# EAGLE design mainboard (EAGLE 7.5.0)
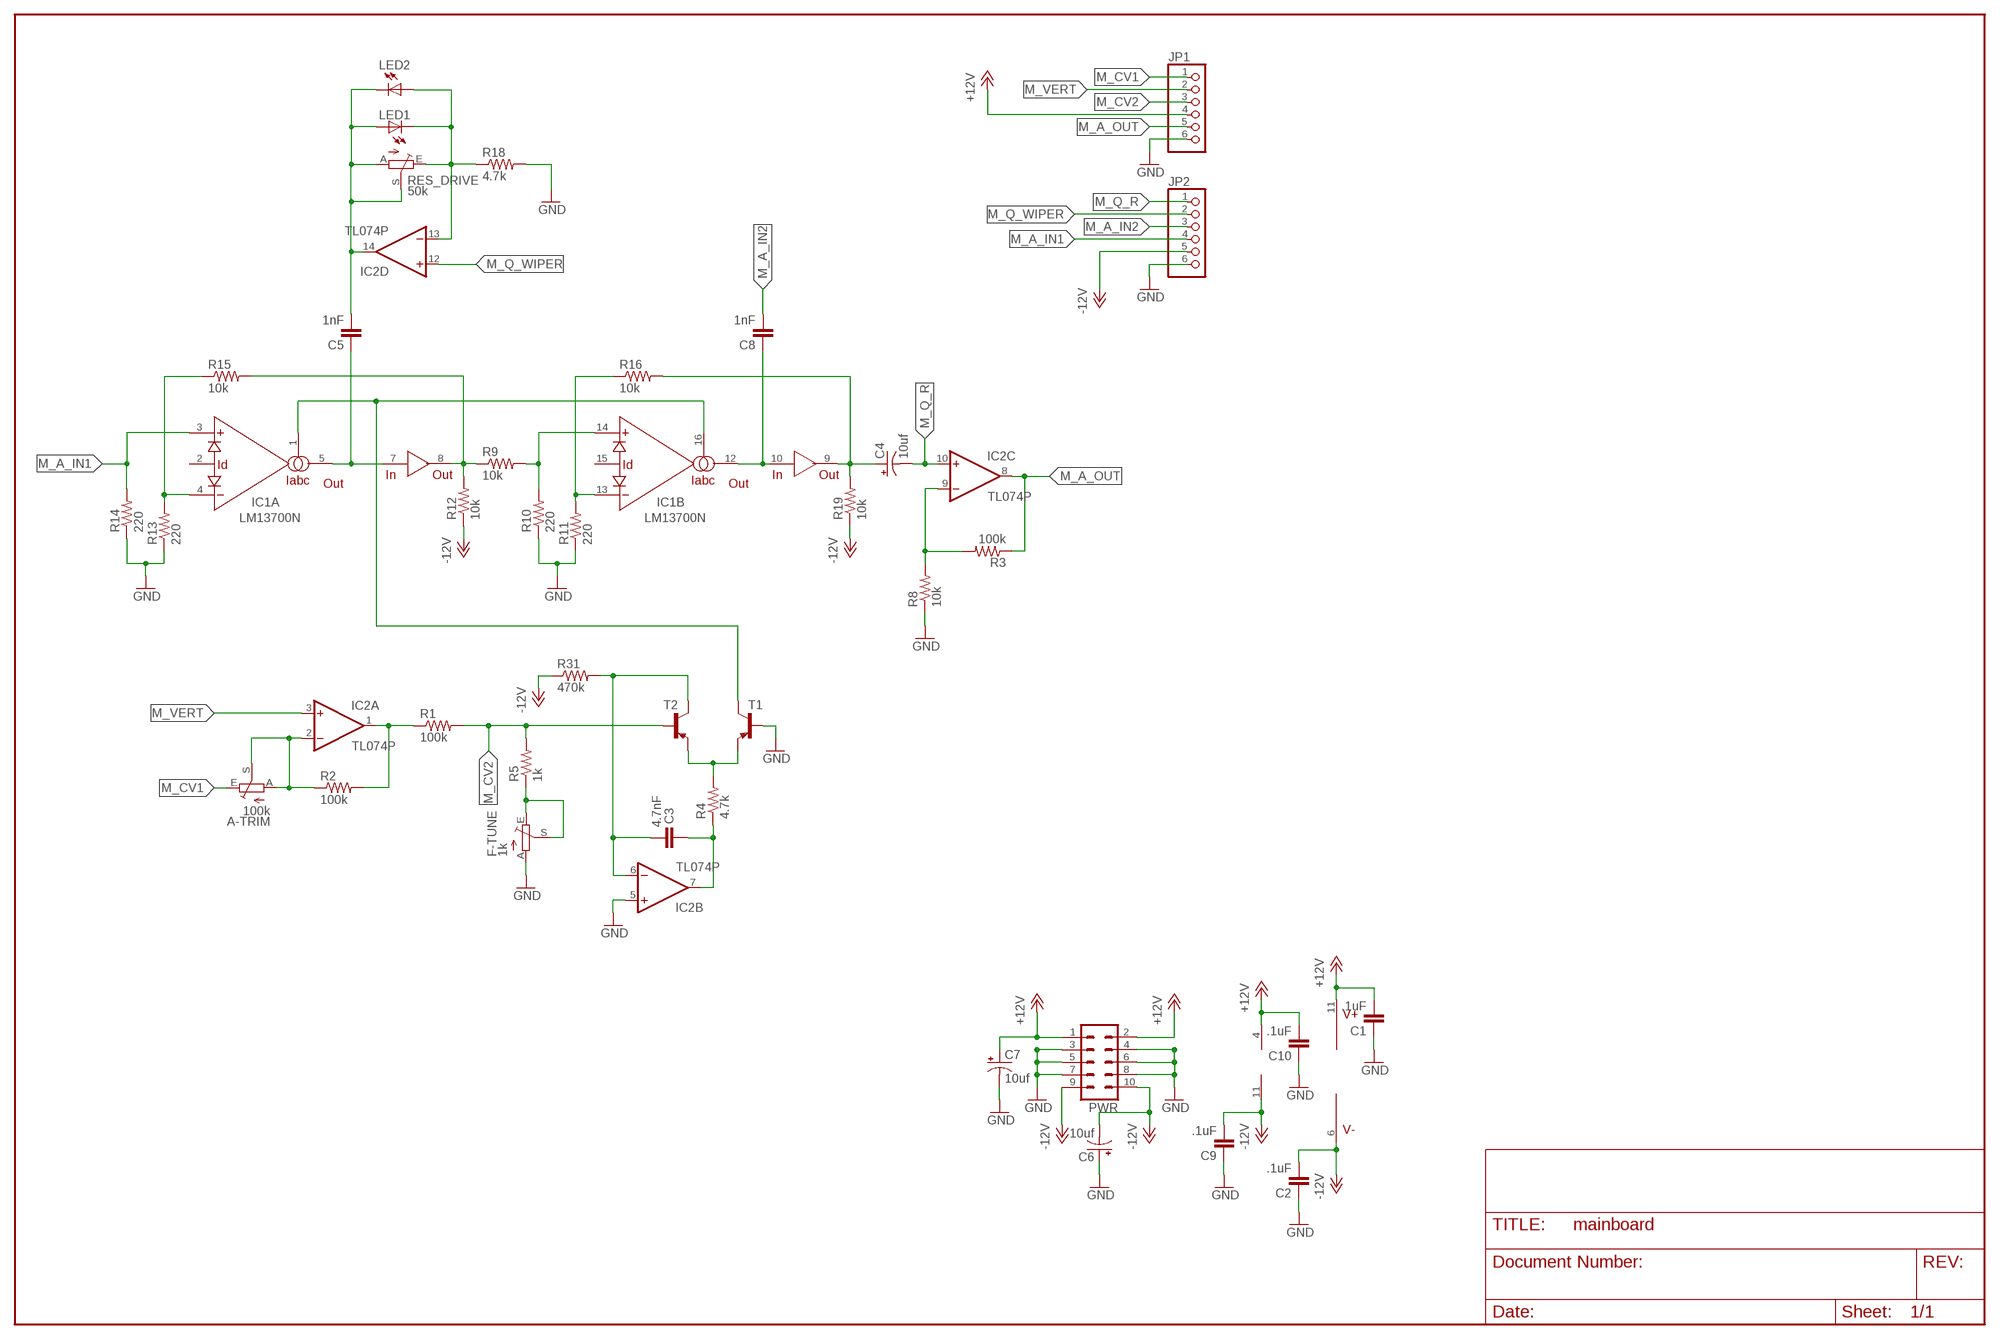
[diagram p0: schematic, sheet 1]

## Parts
A-TRIM  100k  TRIM_1234-S64YW  [S64YW]
C1  .1uF  C-EU050-024X044  [C050-024X044]
C2  .1uF  C-EU050-024X044  [C050-024X044]
C3  4.7nF  C-EU050-024X044  [C050-024X044]
C4  10uf  CPOL-USE2.5-5  [E2,5-5]
C5  1nF  C-EU050-025X075  [C050-025X075]
C6  10uf  CPOL-USE2.5-5  [E2,5-5]
C7  10uf  CPOL-USE2.5-5  [E2,5-5]
C8  1nF  C-EU050-025X075  [C050-025X075]
C9  .1uF  C-EU050-024X044  [C050-024X044]
C10  .1uF  C-EU050-024X044  [C050-024X044]
F-TUNE  1k  TRIM_1234-S64YW  [S64YW]
IC1  LM13700N  [DIL16]
IC2  TL074P  [DIL14]
JP1  PINHD-1X6  [1X06]
JP2  PINHD-1X6  [1X06]
LED1  LED3MM  [LED3MM]
LED2  LED3MM  [LED3MM]
PWR  ML10  [ML10]
R1  100k  R-US_0207/7  [0207/7]
R2  100k  R-US_0207/7  [0207/7]
R3  100k  R-US_0207/7  [0207/7]
R4  4.7k  R-US_0207/7  [0207/7]
R5  1k  R-US_0207/7  [0207/7]
R8  10k  R-US_0207/7  [0207/7]
R9  10k  R-US_0207/7  [0207/7]
R10  220  R-US_0207/7  [0207/7]
R11  220  R-US_0207/7  [0207/7]
R12  10k  R-US_0207/7  [0207/7]
R13  220  R-US_0207/7  [0207/7]
R14  220  R-US_0207/7  [0207/7]
R15  10k  R-US_0207/7  [0207/7]
R16  10k  R-US_0207/7  [0207/7]
R18  4.7k  R-US_0207/7  [0207/7]
R19  10k  R-US_0207/7  [0207/7]
R31  470k  R-US_0207/7  [0207/7]
RES_DRIVE  50k  TRIM_1234-S64YW  [S64YW]
T1  2N3906-PNP-TO92-EBC  [TO92-EBC]
T2  2N3906-PNP-TO92-EBC  [TO92-EBC]

## Nets
+12V: C1.2 C7.+ C10.2 IC1.11(V+) IC2.4(P:V+) JP1.4 PWR.1 PWR.2
-12V: C2.2 C6.- C9.2 IC1.6(V-) IC2.11(P:V-) JP2.5 PWR.9 PWR.10 R12.1 R19.1 R31.1
GND: C1.1 C2.1 C6.+ C7.- C9.1 C10.1 F-TUNE.A IC2.5(B:+IN) JP1.6 JP2.6 PWR.3 PWR.4 PWR.5 PWR.6 PWR.7 PWR.8 R8.1 R10.1 R11.1 R13.1 R14.1 R18.2 T1.B
M_A_IN1: IC1.3(A:+IN) JP2.4 R14.2
M_A_IN2: C8.2 JP2.3
M_A_OUT: IC2.8(C:OUT) JP1.5 R3.1
M_CV1: A-TRIM.E JP1.1
M_CV2: JP1.3 R1.2 R5.2 T2.B
M_Q_R: C4.- IC2.10(C:+IN) JP2.1
M_Q_WIPER: IC2.12(D:+IN) JP2.2
M_VERT: IC2.3(A:+IN) JP1.2
N$1: IC2.1(A:OUT) R1.1 R2.2
N$3: R4.2 T1.E T2.E
N$4: A-TRIM.A A-TRIM.S IC2.2(A:-IN) R2.1
N$7: C3.1 IC2.7(B:OUT) R4.1
N$8: C5.2 IC2.14(D:OUT) LED1.A LED2.K(C) RES_DRIVE.A RES_DRIVE.S
N$9: IC1.4(A:-IN) R13.2 R15.1
N$10: IC1.14(B:+IN) R9.2 R10.2
N$13: IC2.9(C:-IN) R3.2 R8.2
N$15: C8.1 IC1.10(IN) IC1.12(B:OUT)
N$16: C4.+ IC1.9(OUT) R16.2 R19.2
N$17: IC1.13(B:-IN) R11.2 R16.1
N$18: IC2.13(D:-IN) LED1.K(C) LED2.A R18.1 RES_DRIVE.E
N$19: C5.1 IC1.5(A:OUT) IC1.7(IN)
N$20: IC1.1(A:IABC) IC1.16(B:IABC) T1.C
N$23: F-TUNE.E F-TUNE.S R5.1
N$25: IC1.8(OUT) R9.1 R12.2 R15.2
N$35: C3.2 IC2.6(B:-IN) R31.2 T2.C
Unconnected: A-TRIM.S@1(S) F-TUNE.S@1(S) IC1.2(A:ID) IC1.15(B:ID) RES_DRIVE.S@1(S)

## Library data of the parts
A-TRIM F-TUNE RES_DRIVE = pot:TRIM_1234-: POTENTIOMETER
C1-C3 C5 C8-C10 = resistor:C-EU: CAPACITOR, European symbol
C4 C6 C7 = resistor:CPOL-US: POLARIZED CAPACITOR, American symbol
IC1 = synthdiy:LM13700: National Dual OTA with buffers.
IC2 = linear:TL074: OP AMP
JP1 JP2 = pinhead:PINHD-1X6: PIN HEADER
LED1 LED2 = led:LED: LED OSRAM: - CHIPLED LG R971, LG N971, LY N971, LG Q971, LY Q971, LO R971, LY R971 LH N974, LH R974 LS Q976, LO Q976, LY Q976 LO Q996 - Hyper CHIPLED LW Q18S LB Q993, LB Q99A, LB R99A - SideLED LS A670, LO A670, LY A670, LG A670, LP A670 LB A673, LV A673, LT A673, LW A673 LH A674 LY A675 LS A676, LA A676, LO A676, LY A676, LW A676 LS A679, LY A679, LG A679 - Hyper Micro SIDELED® LS Y876, LA Y876, LO Y876, LY Y876 LT Y87S - SmartLED LW L88C, LW L88S LB L89C, LB L89S, LG L890 LS L89K, LO L89K, LY L89K LS L896, LA L896, LO L896, LY L896 - TOPLED LS T670, LO T670, LY T670, LG T670, LP T670 LSG T670, LSP T670, LSY T670, LOP T670, LYG T670 LG T671, LOG T671, LSG T671 LB T673, LV T673, LT T673, LW T673 LH T674 LS T676, LA T676, LO T676, LY T676, LB T676, LH T676, LSB T676, LW T676 LB T67C, LV T67C, LT T67C, LS T67K, LO T67K, LY T67K, LW E67C LS E67B, LA E67B, LO E67B, LY E67B, LB E67C, LV E67C, LT E67C LW T67C LS T679, LY T679, LG T679 LS T770, LO T770, LY T770, LG T770, LP T770 LB T773, LV T773, LT T773, LW T773 LH T774 LS E675, LA E675, LY E675, LS T675 LS T776, LA T776, LO T776, LY T776, LB T776 LHGB T686 LT T68C, LB T68C - Hyper Mini TOPLED® LB M676 - Mini TOPLED Santana® LG M470 LS M47K, LO M47K, LY M47K Source: http://www.osram.convergy.de LUXEON: - LUMILED® LXK2-PW12-R00, LXK2-PW12-S00, LXK2-PW14-U00, LXK2-PW14-V00 LXK2-PM12-R00, LXK2-PM12-S00, LXK2-PM14-U00 LXK2-PE12-Q00, LXK2-PE12-R00, LXK2-PE12-S00, LXK2-PE14-T00, LXK2-PE14-U00 LXK2-PB12-K00, LXK2-PB12-L00, LXK2-PB12-M00, LXK2-PB14-N00, LXK2-PB14-P00, LXK2-PB14-Q00 LXK2-PR12-L00, LXK2-PR12-M00, LXK2-PR14-Q00, LXK2-PR14-R00 LXK2-PD12-Q00, LXK2-PD12-R00, LXK2-PD12-S00 LXK2-PH12-R00, LXK2-PH12-S00 LXK2-PL12-P00, LXK2-PL12-Q00, LXK2-PL12-R00 Source: www.luxeon.com KINGBRIGHT: KA-3528ASYC Source: www.kingbright.com
PWR = con-ml:ML10: HARTING; OC_FARNELL: unknown; OC_NEWARK: unknown
R1-R5 R8-R16 R18 R19 R31 = resistor:R-US_: RESISTOR, American symbol
T1 T2 = transistor-neu-to92:*-PNP-: PNP Transistror

## Board
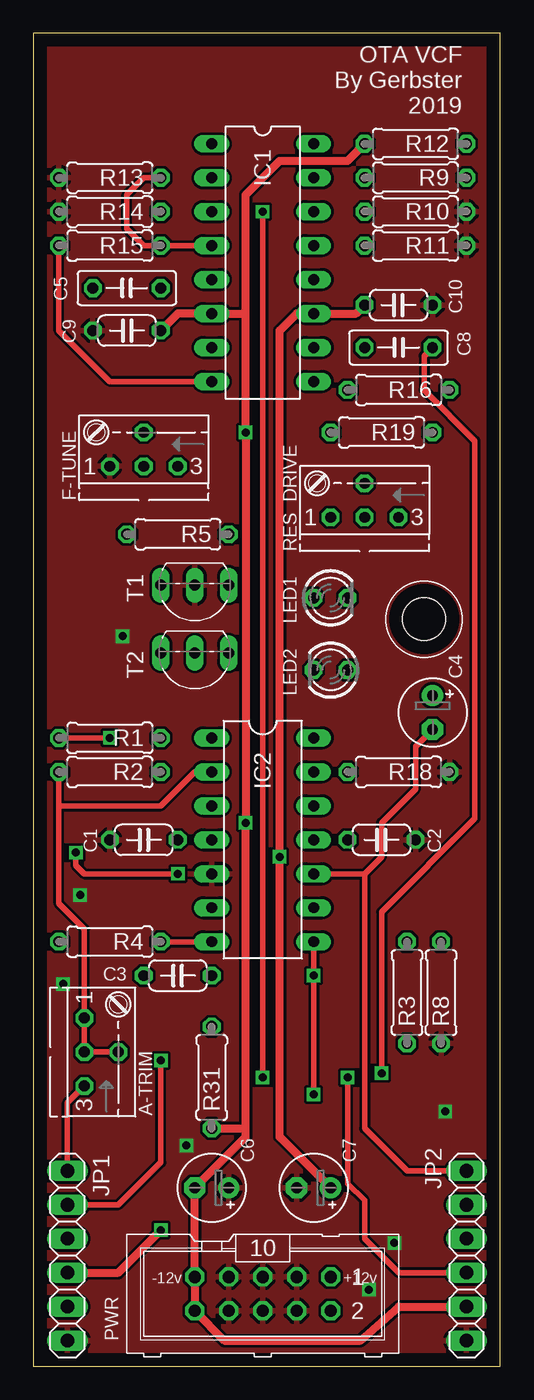
[diagram p1: board, top side]
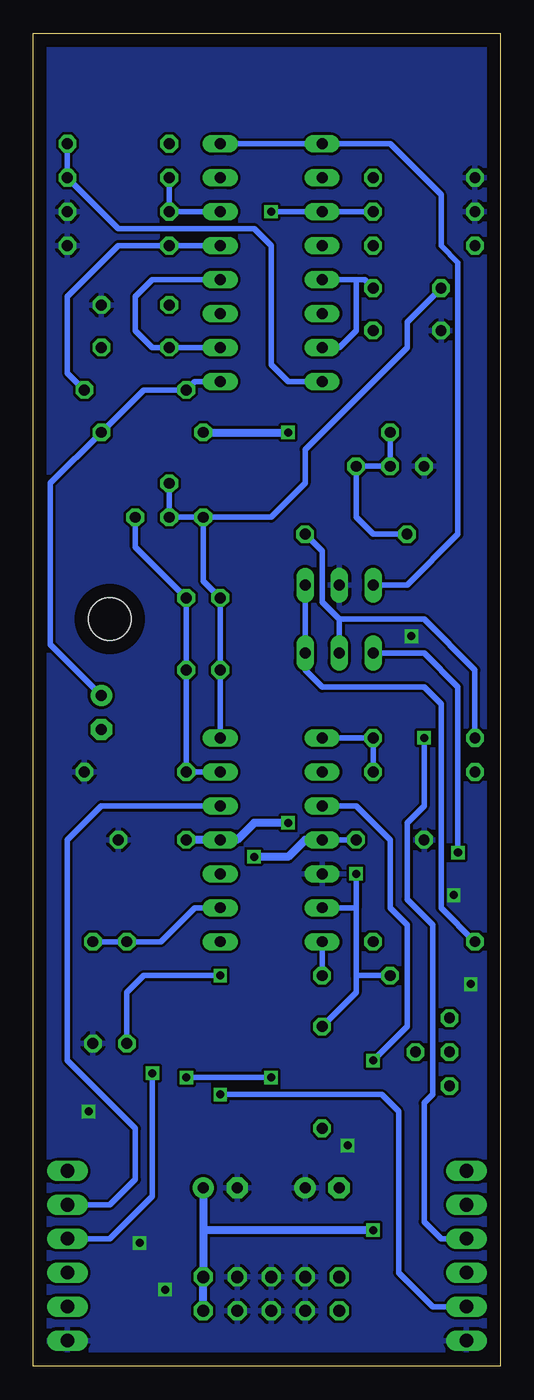
[diagram p2: board, bottom side, seen from below]

Size 34.92 x 99.69 mm. Coordinates in mm from the lower left corner, seen from the top.
Outline: 34.92,0 34.92,99.69 0,99.69 0,0 34.92,0
Copper layers (1*16): Top 0.035mm / dielectric 1.5mm / Bottom 0.035mm
Design rules "default": minimum track width 10mil, minimum drill 24mil, track to track 8mil, track to pad 8mil, pad to pad 8mil, via to via 8mil, smd to smd 8mil, copper to edge 40mil, drill to drill 8mil, minimum pad ring 10mil, minimum via ring 8mil, stop-mask expansion 4mil, vias tented up to drill 0mil, thermal gap 10mil
Holes 3.2 mm at 29.21,55.88

### Footprints (pad centres in the part's own frame; a part is rotated, then mirrored left to right if it is on the bottom)
S64YW = drill 0.813 octagon: A 2.54,1.27; E -2.54,1.27; S 0,-1.27; S@1 0,1.27
C050-024X044 = drill 0.813 octagon: 1 -2.54,0; 2 2.54,0
E2,5-5 = drill 0.813 pad 1.6: + -1.27,0 | drill 0.813 pad 1.6 octagon: - 1.27,0
C050-025X075 = drill 0.813 octagon: 1 -2.54,0; 2 2.54,0
DIL16 = drill 0.813 long: 1 -8.89,-3.81; 2 -6.35,-3.81; 3 -3.81,-3.81; 4 -1.27,-3.81; 5 1.27,-3.81; 6 3.81,-3.81; 7 6.35,-3.81; 8 8.89,-3.81; 9 8.89,3.81; 10 6.35,3.81; 11 3.81,3.81; 12 1.27,3.81; 13 -1.27,3.81; 14 -3.81,3.81; 15 -6.35,3.81; 16 -8.89,3.81
DIL14 = drill 0.813 long: 1 -7.62,-3.81; 2 -5.08,-3.81; 3 -2.54,-3.81; 4 0,-3.81; 5 2.54,-3.81; 6 5.08,-3.81; 7 7.62,-3.81; 8 7.62,3.81; 9 5.08,3.81; 10 2.54,3.81; 11 0,3.81; 12 -2.54,3.81; 13 -5.08,3.81; 14 -7.62,3.81
1X06 = drill 1.016 long: 1 -6.35,0; 2 -3.81,0; 3 -1.27,0; 4 1.27,0; 5 3.81,0; 6 6.35,0
LED3MM = drill 0.813 octagon: A -1.27,0; K 1.27,0
ML10 = drill 0.914 octagon: 1 -5.08,-1.27; 2 -5.08,1.27; 3 -2.54,-1.27; 4 -2.54,1.27; 5 0,-1.27; 6 0,1.27; 7 2.54,-1.27; 8 2.54,1.27; 9 5.08,-1.27; 10 5.08,1.27
0207/7 = drill 0.813 octagon: 1 -3.81,0; 2 3.81,0
TO92-EBC = drill 0.813 long: B 0,-1.27; C 2.54,-1.27; E -2.54,-1.27

### Placement (x,y rotation side)
A-TRIM  5.08,23.5 90 top
C1  8.26,39.37 0 top
C2  26.04,39.37 180 top
C3  10.79,29.21 180 top
C4  29.84,48.9 270 top
C5  6.99,80.64 180 top
C6  13.34,13.34 180 top
C7  20.95,13.34 180 top
C8  27.3,76.2 0 top
C9  6.99,77.47 0 top
C10  27.3,79.38 180 top
F-TUNE  8.26,68.58 180 top
IC1  17.14,82.55 270 top
IC2  17.14,39.37 270 top
JP1  2.54,8.26 270 top
JP2  32.38,8.26 270 top
LED1  22.23,57.47 0 top
LED2  22.23,52.07 180 top
PWR  17.14,5.4 180 top
R1  5.71,46.99 180 top
R2  5.71,44.45 0 top
R3  27.94,27.94 90 top
R4  5.71,31.75 180 top
R5  10.79,62.23 0 top
R8  30.48,27.94 90 top
R9  28.57,88.9 180 top
R10  28.57,86.36 180 top
R11  28.57,83.82 180 top
R12  28.57,91.44 0 top
R13  5.71,88.9 0 top
R14  5.71,86.36 0 top
R15  5.71,83.82 180 top
R16  27.3,73.03 180 top
R18  27.3,44.45 0 top
R19  26.04,69.85 0 top
R31  13.34,21.59 90 top
RES_DRIVE  24.77,64.77 180 top
T1  12.06,57.15 180 top
T2  12.06,52.07 180 top

### Tracks (layer width: path | path; a pad name or v marks a point on that pad's centre or on a via)
+12V  (via drill 0.6)
  Top 0.61: C7.+ 18.41,17.14 v18.41,38.1 18.41,77.47 19.68,78.74 IC1.11 24.13,78.74 C10.2 | JP1.4 6.35,6.99 v9.53,10.16
  Bottom 0.406: C1.2 IC2.4
  Bottom 0.61: PWR.2 PWR.1 22.23,10.16 | IC2.4 14.61,39.37 15.88,38.1 v18.41,38.1 | C7.+ 22.23,10.16 | v9.53,10.16 22.23,10.16
-12V  (via drill 0.6)
  Top 0.61: 15.88,17.78 15.88,17.14 C6.- PWR.9 PWR.10 14.29,1.91 24.45,1.91 27.3,4.45 JP2.5 | 15.88,78.74 v15.88,69.85 v15.88,40.64 15.88,17.78 | C9.2 10.79,78.74 IC1.6 15.88,78.74 | R31.1 15.88,17.78 | 15.88,78.74 15.88,87.63 18.41,90.17 23.5,90.17 R12.1
  Bottom 0.61: v15.88,40.64 18.41,40.64 19.68,39.37 IC2.11 C2.2 | R19.1 v15.88,69.85
GND  (via drill 0.6)
  other vias: 2.22,28.57 6.67,54.61 25.08,5.71 11.43,16.51 3.49,35.24 30.8,19.05 26.99,9.21
  pour Bottom: 0,0 34.92,0 34.92,100.01 0,99.69
  pour Top: 0,0 34.92,0 34.92,100.01 0,99.69
M_A_IN1  (via drill 0.6)
  Top 0.406: JP2.4 27.3,6.99 24.77,9.53 24.77,12.38 23.5,13.65 v23.5,21.59 | v17.14,86.36 v17.14,21.59
  Bottom 0.406: R14.2 IC1.3 v17.14,86.36 | v17.14,21.59 v23.5,21.59
M_A_IN2  (via drill 0.6)
  Top 0.406: C8.2 29.21,75.56 29.21,73.03 33.02,69.22 33.02,40.96 26.04,33.97 v26.04,21.91
  Bottom 0.406: v26.04,21.91 26.04,12.7 29.21,9.53 JP2.3
M_A_OUT  (via drill 0.6)
  Top 0.406: IC2.8 v20.95,29.21 v20.95,20.32
  Bottom 0.406: v20.95,20.32 8.89,20.32 7.62,19.05 7.62,6.99 5.08,4.45 JP1.5 | R3.1 27.94,27.94 26.67,29.21 v20.95,29.21
M_CV1
  Top 0.406: JP1.1 2.54,19.68 A-TRIM.E
M_CV2  (via drill 0.6)
  Top 0.406: R1.2 v5.71,46.99
  Bottom 0.406: R1.2 1.91,52.07 5.71,55.88 12.06,55.88 | 12.06,55.88 T2.B | 12.06,55.88 13.34,57.15 13.34,60.96 R5.2 | v5.71,46.99 5.71,41.91 6.99,40.64 6.99,34.92 5.08,33.02 5.08,20.32 5.71,19.68 5.71,10.79 4.45,9.53 JP1.3
M_Q_R
  Top 0.406: 24.77,36.83 26.04,38.1 26.04,40.64 28.57,43.18 28.57,46.35 C4.- | IC2.10 24.77,36.83 | 24.77,36.83 24.77,17.78 27.94,14.61 JP2.1
M_Q_WIPER
  Bottom 0.406: JP2.2 29.21,12.06 27.3,13.97 27.3,17.78 32.38,22.86 32.38,39.37 29.84,41.91 IC2.12
M_VERT  (via drill 0.6)
  Top 0.406: JP1.2 6.35,12.06 9.53,15.24 v9.53,22.86
  Bottom 0.406: v9.53,22.86 6.99,25.4 6.99,33.02 8.26,34.29 8.26,39.37 10.79,41.91 IC2.3
N$1
  Bottom 0.406: IC2.1 R1.1 R2.2
N$3
  Bottom 0.406: T1.E T2.E 14.61,52.07 13.34,50.8 5.71,50.8 4.45,49.53 4.45,34.29 R4.2
N$4
  Top 0.406: 1.91,41.91 9.53,41.91 12.06,44.45 IC2.2 | 1.91,41.91 1.91,34.61 3.81,32.7 A-TRIM.A 3.81,23.5 A-TRIM.S | 1.91,41.91 R2.1
N$7
  Top 0.406: R4.1 IC2.7
  Bottom 0.406: IC2.7 C3.1
N$8
  Bottom 0.406: C5.2 6.99,78.11 6.99,76.2 14.61,68.58 14.61,66.04 17.14,63.5 RES_DRIVE.A | RES_DRIVE.A 22.23,58.74 LED1.A LED2.K IC2.14 | RES_DRIVE.A 24.77,63.5 RES_DRIVE.S
N$9
  Top 0.406: IC1.4 R15.1 8.26,83.82 6.99,85.09 6.99,87.63 8.26,88.9 R13.2
N$10
  Bottom 0.406: IC1.14 R10.2 R9.2
N$13
  Bottom 0.406: IC2.9 22.86,34.29 25.4,31.75 R8.2 R3.2
N$15
  Bottom 0.406: IC1.10 C8.1 26.04,76.2 27.3,77.47 27.3,80.01 26.04,81.28 IC1.12
N$16
  Bottom 0.406: IC1.9 22.86,73.66 R16.2 26.67,73.03 R19.2 33.66,66.04 33.66,53.98 C4.+
N$17
  Bottom 0.406: IC1.13 R11.2 28.57,83.82 32.38,80.01 32.38,74.3 R16.1
N$18
  Bottom 0.406: IC2.13 R18.1 LED2.A LED1.K 27.3,61.28 RES_DRIVE.E
N$19
  Bottom 0.406: 10.79,81.28 10.16,81.28 C5.1 | IC1.7 12.06,76.2 10.79,77.47 10.79,81.28 | 10.79,81.28 IC1.5
N$20
  Bottom 0.406: IC1.16 IC1.1 8.26,91.44 4.45,87.63 4.45,83.82 3.17,82.55 3.17,62.23 6.99,58.42 T1.C
N$23
  Bottom 0.406: R5.1 9.53,62.23 10.79,63.5 F-TUNE.E 8.26,67.31 F-TUNE.S
N$25
  Top 0.406: IC1.8 5.71,73.66 1.91,77.47 R15.2
  Bottom 0.406: IC1.8 15.88,73.66 17.14,74.93 17.14,83.82 18.41,85.09 28.57,85.09 R9.1 R12.2
N$35  (via drill 0.6)
  Top 0.406: v3.17,38.42 3.17,37.47 3.81,36.83 v10.79,36.83
  Bottom 0.406: 10.79,29.21 10.79,27.94 R31.2 | C3.2 10.79,29.21 | 10.79,29.21 10.79,34.29 | 10.79,34.29 IC2.6 | T2.C 5.71,53.34 3.17,50.8 v3.17,38.42 | v10.79,36.83 10.79,34.29

### Text on the board
tNames: OTA VCF / By Gerbster / 2019 | -12v | +12v